# EAGLE schematic Spark (EAGLE 7.1.0)
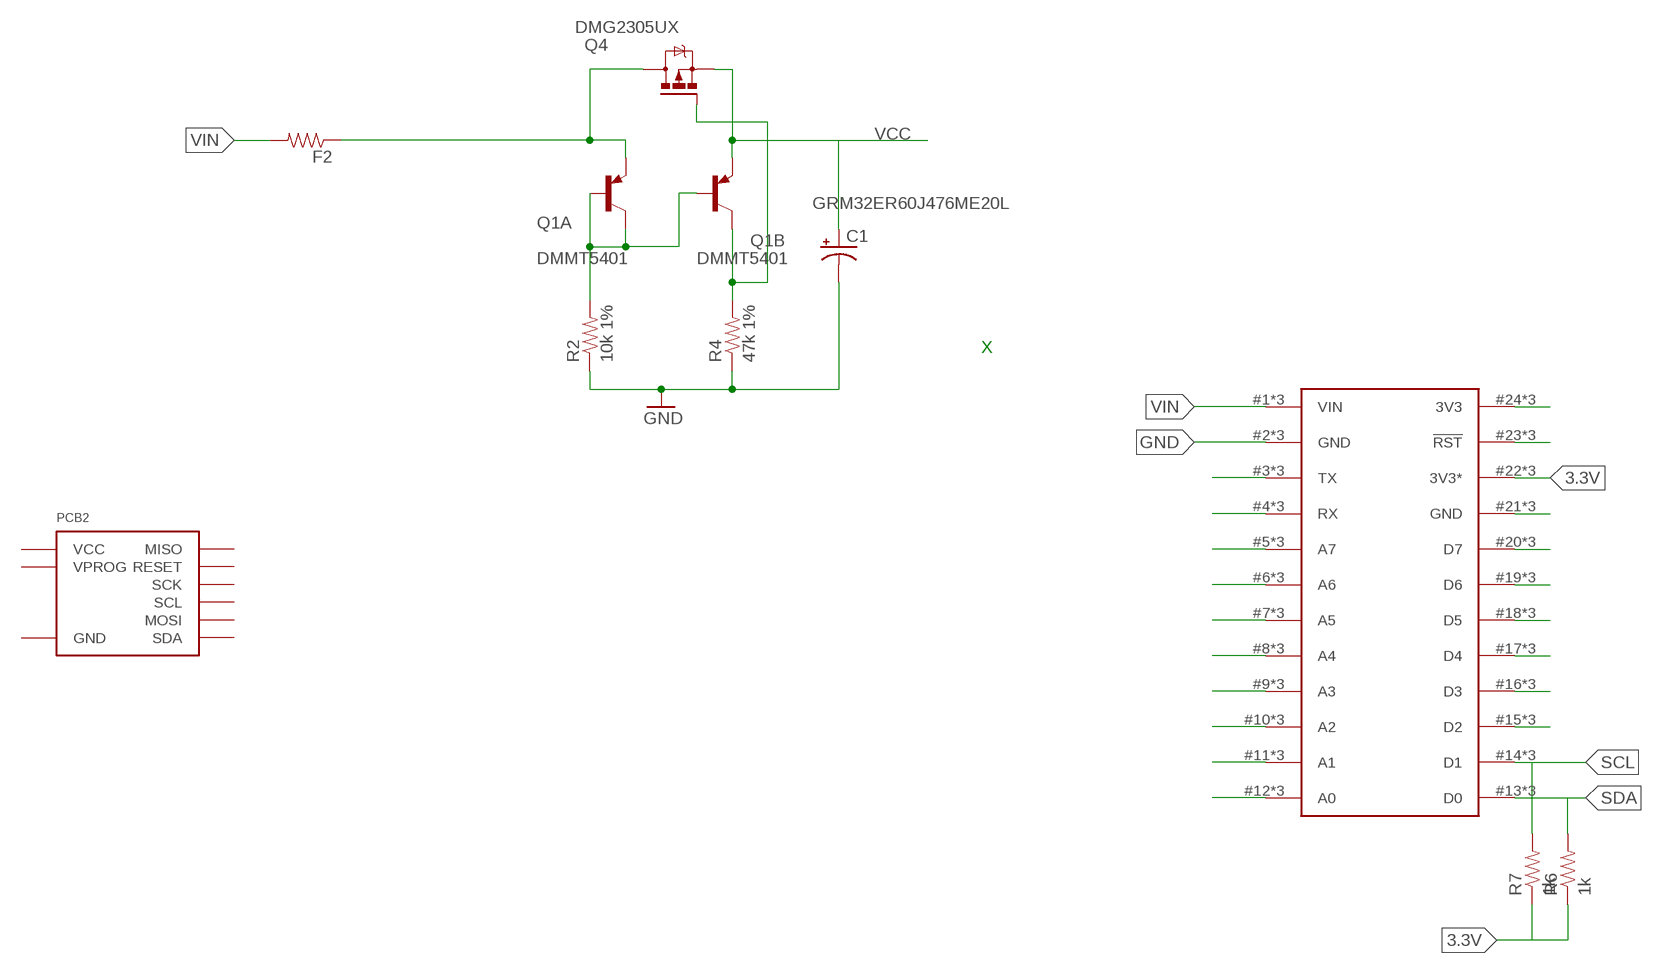
[diagram p0: schematic, sheet 1]

## Parts
C1  CAP_POLC  [PANASONIC_C]
F2  RESISTOR0805-RES  [0805]
PCB2  EXCLUDE  DEVICE-PCB  [DEVICE-PCB]
Q1  DMMT5401  TRANSISTOR-DUAL-PNP  [SOT-26]
Q4  DMG2305UX  IRLML5203  [MICRO3]
R2  10k 1%  RESISTOR0805-RES  [0805]
R4  47k 1%  RESISTOR0805-RES  [0805]
R6  1k  RESISTOR0805-RES  [0805]
R7  1k  RESISTOR0805-RES  [0805]
U$1  SPARK_CORE  [SPARK_CORE_STACKABLE]

## Nets
3.3V: R6.1 R7.1 U$1.22(3V3*) U$1.#22(3V3*) U$1.@22(3V3*)
GND: C1.- R2.1 R4.1 U$1.2(GND) U$1.#2(GND) U$1.@2(GND)
N$22: Q1.1(A:C) Q1.2(A:B) Q1.3(B:B) R2.2
N$23: Q1.4(B:C) Q4.1(G) R4.2
N$24: U$1.3(TX) U$1.#3(TX) U$1.@3(TX)
N$25: U$1.4(RX) U$1.#4(RX) U$1.@4(RX)
N$26: U$1.5(A7) U$1.#5(A7) U$1.@5(A7)
N$27: U$1.6(A6) U$1.#6(A6) U$1.@6(A6)
N$28: U$1.7(A5) U$1.#7(A5) U$1.@7(A5)
N$29: U$1.8(A4) U$1.#8(A4) U$1.@8(A4)
N$30: U$1.9(A3) U$1.#9(A3) U$1.@9(A3)
N$31: U$1.10(A2) U$1.#10(A2) U$1.@10(A2)
N$32: U$1.11(A1) U$1.#11(A1) U$1.@11(A1)
N$33: U$1.12(A0) U$1.#12(A0) U$1.@12(A0)
N$34: U$1.24(3V3) U$1.#24(3V3) U$1.@24(3V3)
N$35: U$1.23(!RST) U$1.#23(!RST) U$1.@23(!RST)
N$36: U$1.21(GND) U$1.#21(GND) U$1.@21(GND)
N$37: U$1.20(D7) U$1.#20(D7) U$1.@20(D7)
N$38: U$1.19(D6) U$1.#19(D6) U$1.@19(D6)
N$39: U$1.18(D5) U$1.#18(D5) U$1.@18(D5)
N$40: U$1.17(D4) U$1.#17(D4) U$1.@17(D4)
N$41: U$1.16(D3) U$1.#16(D3) U$1.@16(D3)
N$42: U$1.15(D2) U$1.#15(D2) U$1.@15(D2)
SCL: R7.2 U$1.14(D1) U$1.#14(D1) U$1.@14(D1)
SDA: R6.2 U$1.13(D0) U$1.#13(D0) U$1.@13(D0)
VCC: C1.+ Q1.5(B:E) Q4.2(S)
VIN: F2.2 U$1.1(VIN) U$1.#1(VIN) U$1.@1(VIN)
VREG1: F2.1 Q1.6(A:E) Q4.3(D)
Unconnected: PCB2.BUS0(GND) PCB2.BUS1(SDA) PCB2.BUS2(VCC) PCB2.BUS3(SCL) PCB2.PROG0(VPROG) PCB2.PROG1(RESET) PCB2.PROG2(SCK) PCB2.PROG3(MISO) PCB2.PROG4(MOSI)

## Notes on the sheet
- GRM32ER60J476ME20L
- X

## Library data of the parts
C1 = IntegerLabs:CAP_POL: Capacitor Polarized These are standard SMD and PTH capacitors. Normally 10uF, 47uF, and 100uF in electrolytic and tantalum varieties. Always verify the external diameter of the through hole cap, it varies with capacity, voltage, and manufacturer. The EIA devices should be standard.
F2 R2 R4 R6 R7 = SparkFun-Passives:RESISTOR: Resistor Basic schematic elements and footprints for 0603, 1206, and PTH resistors.
PCB2 = Modulo:DEVICE-PCB: Modulo Footprint
Q1 = IntegerLabs:TRANSISTOR-DUAL-PNP: PNP Transistor
Q4 = transistor-power:IRLML5203: HEXFET P-Channel Power MOSFET
U$1 = Spark:SPARK_CORE